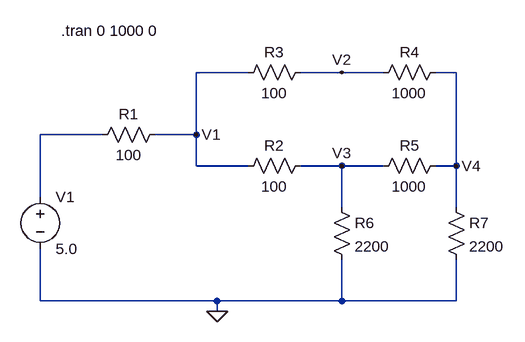
[diagram p0: schematic prelab1_part1a.asc]
prelab1_part1a.asc, the LTspice schematic file:
Version 4
SHEET 1 880 680
WIRE 224 0 144 0
WIRE 368 0 304 0
WIRE 432 0 368 0
WIRE 544 0 512 0
WIRE 0 96 -96 96
WIRE 144 96 144 0
WIRE 144 96 80 96
WIRE 144 144 144 96
WIRE 224 144 144 144
WIRE 368 144 304 144
WIRE 432 144 368 144
WIRE 544 144 544 0
WIRE 544 144 512 144
WIRE -96 192 -96 96
WIRE 368 208 368 144
WIRE 544 208 544 144
WIRE -96 352 -96 272
WIRE 176 352 -96 352
WIRE 368 352 368 288
WIRE 368 352 176 352
WIRE 544 352 544 288
WIRE 544 352 368 352
WIRE 176 368 176 352
FLAG 176 368 0
FLAG 144 96 V1
FLAG 368 0 V2
FLAG 544 144 V4
FLAG 368 144 V3
SYMBOL res -16 112 R270
WINDOW 0 32 56 VTop 2
WINDOW 3 0 56 VBottom 2
SYMATTR InstName R1
SYMATTR Value 100
SYMBOL res 208 160 R270
WINDOW 0 32 56 VTop 2
WINDOW 3 0 56 VBottom 2
SYMATTR InstName R2
SYMATTR Value 100
SYMBOL res 208 16 R270
WINDOW 0 32 56 VTop 2
WINDOW 3 0 56 VBottom 2
SYMATTR InstName R3
SYMATTR Value 100
SYMBOL res 416 16 R270
WINDOW 0 32 56 VTop 2
WINDOW 3 0 56 VBottom 2
SYMATTR InstName R4
SYMATTR Value 1000
SYMBOL res 416 160 R270
WINDOW 0 32 56 VTop 2
WINDOW 3 0 56 VBottom 2
SYMATTR InstName R5
SYMATTR Value 1000
SYMBOL res 352 192 R0
SYMATTR InstName R6
SYMATTR Value 2200
SYMBOL res 528 192 R0
SYMATTR InstName R7
SYMATTR Value 2200
SYMBOL voltage -96 176 R0
WINDOW 123 0 0 Left 0
WINDOW 39 0 0 Left 0
SYMATTR InstName V1
SYMATTR Value 5.0
TEXT -64 -64 Left 2 !.tran 0 1000 0

The netlist it stands for:
* prelab1_part1a.asc
R1 N001 V1 100
R2 V1 V3 100
R3 V1 V2 100
R4 V2 V4 1000
R5 V3 V4 1000
R6 V3 0 2200
R7 V4 0 2200
V1 N001 0 5.0
.tran 0 1000 0
.backanno
.end